# Altium project CanRotor_Mini(ver.8).PrjPcb
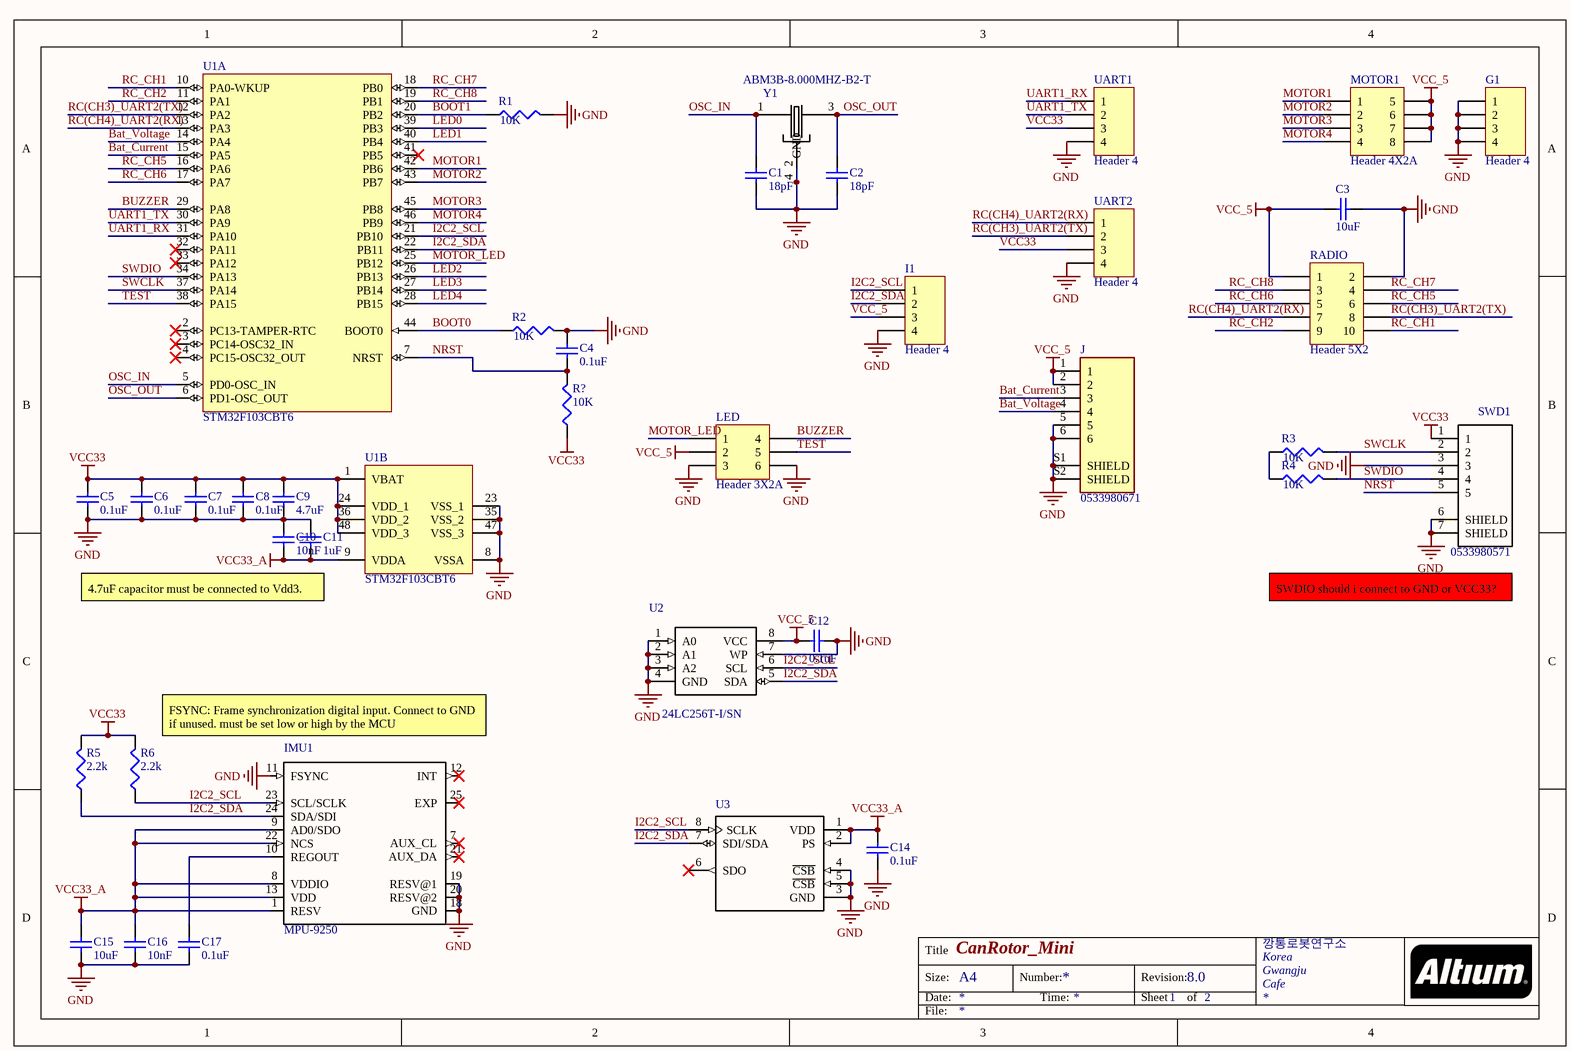
[diagram p0: CanRotor_Mini(1).SchDoc]
2 sheets, 58 parts. Net scope: global (net labels, ports and power ports of the same name join across sheets).
Board file: CanRotor_Mini(PCB).PcbDoc
Sheets:
  CanRotor_Mini(1).SchDoc
  CanRotor_Mini(2).SchDoc

## Sheet CanRotor_Mini(1).SchDoc: CanRotor_Mini
size A4; Author: WHS; Organization: 깡통로봇연구소; Address1: Korea; Address2: Gwangju; Address3: Cafe; Revision: 8.0; SheetNumber: 1; SheetTotal: 2; ProjectName: CanRotor_Mini

### Parts
C1  value 18pF  [1608[0603]]  (hidden comment: Cap Semi)
C2  value 18pF  [1608[0603]]  (hidden comment: Cap Semi)
C3  value 10uF  [6-0805_L]  (hidden comment: Cap Semi)
C4  value 0.1uF  [1608[0603]]  (hidden comment: Cap Semi)
C5  value 0.1uF  [1608[0603]]  (hidden comment: Cap Semi)
C6  value 0.1uF  [1608[0603]]  (hidden comment: Cap Semi)
C7  value 0.1uF  [1608[0603]]  (hidden comment: Cap Semi)
C8  value 0.1uF  [1608[0603]]  (hidden comment: Cap Semi)
C9  value 4.7uF  [6-0805_L]  (hidden comment: Cap Semi)
C10  value 10nF  [1608[0603]]  (hidden comment: Cap Semi)
C11  value 1uF  [1608[0603]]  (hidden comment: Cap Semi)
C12  value 0.1uF  [1608[0603]]  (hidden comment: Cap Semi)
C14  value 0.1uF  [1608[0603]]  (hidden comment: Cap Semi)
C15  value 10uF  [6-0805_L]  (hidden comment: Cap Semi)
C16  value 10nF  [1608[0603]]  (hidden comment: Cap Semi)
C17  value 0.1uF  [1608[0603]]  (hidden comment: Cap Semi)
G1  Header 4  [HDR1X4]
I1  Header 4  [HDR1X4]
IMU1  MPU-9250  [QFN40P300X300X105-25N]
J  0533980671  [MOLEX_0533980671]
LED  Header 3X2A  [HDR2X3_CEN]
MOTOR1  Header 4X2A  [HDR2X4_CEN]
R1  value 10K  [J1-0603]  (hidden comment: Res3)
R2  value 10K  [J1-0603]  (hidden comment: Res3)
R3  value 10K  [J1-0603]  (hidden comment: Res3)
R4  value 10K  [J1-0603]  (hidden comment: Res3)
R5  value 2.2k  [J1-0603]  (hidden comment: Res3)
R6  value 2.2k  [J1-0603]  (hidden comment: Res3)
R?  value 10K  [J1-0603]  (hidden comment: Res3)
RADIO  Header 5X2  [HDR2X5]
SWD1  0533980571  [MOLEX_0533980571_0533980571(Primary)]
U1  STM32F103CBT6  [STM-LQFP48_N]  (parts A,B of 2)
U2  24LC256T-I/SN  [SOIC127P600X175-8N]
U3  MS561101BA03-50  [SON125P500X300X100-8N]  (value not drawn)
UART1  Header 4  [HDR1X4]
UART2  Header 4  [HDR1X4]
Y1  ABM3B-8.000MHZ-B2-T  [OSCSC500X320X110-4N]

### Nets
GND: C1.1 C2.1 C3.2 C4.2 C5.1 C6.1 C7.1 C8.1 C9.2 C10.1 C11.1 C12.1 C14.1 C15.1 C16.1 C17.1 G1.1 G1.2 G1.3 G1.4 I1.4 IMU1.11(FSYNC) IMU1.18(GND) IMU1.19(RESV@1) IMU1.20(RESV@2) J.5 J.6 J.S1(SHIELD) J.S2(SHIELD) LED.3 LED.6 R1.2 R2.2 RADIO.2 SWD1.3 SWD1.6(SHIELD) SWD1.7(SHIELD) U1.8(VSSA) U1.23(VSS_1) U1.35(VSS_2) U1.47(VSS_3) U2.1(A0) U2.2(A1) U2.3(A2) U2.4(GND) U2.7(WP) U3.3(GND) U3.4(~{CSB}) U3.5(~{CSB}) UART1.4 UART2.4 Y1.2(GND) Y1.4(GND)
VCC33: C5.2 C6.2 C7.2 C8.2 C9.1 R5.2 R6.2 R?.1 SWD1.1 U1.1(VBAT) U1.24(VDD_1) U1.36(VDD_2) U1.48(VDD_3) UART1.3 UART2.3
VCC33_A: C10.2 C11.2 C14.2 C15.2 C16.2 IMU1.1(RESV) IMU1.8(VDDIO) IMU1.9(AD0/SDO) IMU1.13(VDD) IMU1.22(NCS) U1.9(VDDA) U3.1(VDD) U3.2(PS)
VCC_5: C3.1 C12.2 I1.3 J.1 J.2 LED.2 MOTOR1.5 MOTOR1.6 MOTOR1.7 MOTOR1.8 RADIO.1 U2.8(VCC)
Bat_Current: J.3 U1.15(PA5)
Bat_Voltage: J.4 U1.14(PA4)
BOOT0: R2.1 U1.44(BOOT0)
BOOT1: R1.1 U1.20(PB2)
BUZZER: LED.4 U1.29(PA8)
I2C2_SCL: I1.1 IMU1.23(SCL/SCLK) R6.1 U1.21(PB10) U2.6(SCL) U3.8(SCLK)
I2C2_SDA: I1.2 IMU1.24(SDA/SDI) R5.1 U1.22(PB11) U2.5(SDA) U3.7(SDI/SDA)
LED0: U1.39(PB3)
LED1: U1.40(PB4)
LED2: U1.26(PB13)
LED3: U1.27(PB14)
LED4: U1.28(PB15)
MOTOR1: MOTOR1.1 U1.42(PB6)
MOTOR2: MOTOR1.2 U1.43(PB7)
MOTOR3: MOTOR1.3 U1.45(PB8)
MOTOR4: MOTOR1.4 U1.46(PB9)
MOTOR_LED: LED.1 U1.25(PB12)
NRST: C4.1 R?.2 SWD1.5 U1.7(NRST)
OSC_IN: C1.2 U1.5(PD0-OSC_IN) Y1.1
OSC_OUT: C2.2 U1.6(PD1-OSC_OUT) Y1.3
RC(CH3)_UART2(TX): RADIO.8 U1.12(PA2) UART2.2
RC(CH4)_UART2(RX): RADIO.7 U1.13(PA3) UART2.1
RC_CH1: RADIO.10 U1.10(PA0-WKUP)
RC_CH2: RADIO.9 U1.11(PA1)
RC_CH5: RADIO.6 U1.16(PA6)
RC_CH6: RADIO.5 U1.17(PA7)
RC_CH7: RADIO.4 U1.18(PB0)
RC_CH8: RADIO.3 U1.19(PB1)
SWCLK: R3.2 SWD1.2 U1.37(PA14)
SWDIO: R4.2 SWD1.4 U1.34(PA13)
TEST: LED.5 U1.38(PA15)
UART1_RX: U1.31(PA10) UART1.1
UART1_TX: U1.30(PA9) UART1.2
NetC17_2: C17.2 IMU1.10(REGOUT)
NetR3_1: R3.1 R4.1

Not connected (* = marked no-connect by the designer): IMU1 7(AUX_CL)* 12(INT)* 21(AUX_DA)* 25(EXP)*; U1 2(PC13-TAMPER-RTC)* 3(PC14-OSC32_IN)* 4(PC15-OSC32_OUT)* 32(PA11)* 33(PA12)* 41(PB5)*; U3 6(SDO)*

### Notes on the sheet
- 4.7uF capacitor must be connected to Vdd3.
- (near SWD1) SWDIO should i connect to GND or VCC33?
- FSYNC: Frame synchronization digital input. Connect to GND if unused. must be set low or high by the MCU
- Title
- Size:
- Date:
- A4
- Number:
- Time:
- Revision:
- Sheet
- of
- File:

### Library data of the parts
C1-C12 C14-C17 = Cap Semi: Capacitor (Semiconductor SIM Model); Published: 8-Jun-2000; LatestRevisionDate: 29-May-2009; LatestRevisionNote: IPC-7351 Footprint Added.; PackageReference: C1206; Publisher: Altium Limited; PackageDescription: Chip Capacitor
G1 I1 UART1 UART2 = Header 4: Header, 4-Pin; LatestRevisionDate: 17-Jul-2002; LatestRevisionNote: Re-released for DXP Platform.; Publisher: Altium Limited
IMU1 = MPU-9250: SMD Gyroscope/Accelerometer/Magnetometer Sensor%3B 9-AXIS; MF: InvenSense; Package: QFN-24 InvenSense; Price: 6.07 USD; MP: MPU-9250; Availability: Warning; Value: *
J = 0533980671: Picoblade Connector, 6 Circuit Single Row, Right Angle Surface Mount SMT PCB; MF: Molex; SnapEDA_Link: https://www.snapeda.com/parts/0533980671/Molex/view-part/49734/?ref=snap; Availability: Unavailable; Value: *; Price: None; MP: 0533980671; Package: None
LED = Header 3X2A: Header, 3-Pin, Dual row; LatestRevisionDate: 17-Jul-2002; LatestRevisionNote: Re-released for DXP Platform.; Publisher: Altium Limited
MOTOR1 = Header 4X2A: Header, 4-Pin, Dual row; LatestRevisionDate: 17-Jul-2002; LatestRevisionNote: Re-released for DXP Platform.; Publisher: Altium Limited
R1-R6 R? = Res3: Resistor; Published: 8-Jun-2000; LatestRevisionDate: 29-May-2009; LatestRevisionNote: IPC-7351 Footprint Added.; PackageReference: J1-0603; Publisher: Altium Limited; PackageDescription: Chip Resistor
RADIO = Header 5X2: Header, 5-Pin, Dual row; LatestRevisionDate: 17-Jul-2002; LatestRevisionNote: Re-released for DXP Platform.; Publisher: Altium Limited
SWD1 = 0533980571: Conn Shrouded Header HDR 5 POS 1.25mm Solder ST SMD PicoBlade횄짖창?혷횂짖 Embossed T/R; MF: Molex, LLC; SnapEDA_Link: https://www.snapeda.com/parts/0533980571/Molex%2C%20LLC/view-part/?ref=snap; Package: None; MP: 0533980571; Availability: Unavailable; Price: None; Value: *
U1 = STM32F103CBT6: ARM Cortex-M3 32-bit MCU, 128 KB Flash, 20 KB Internal RAM, 37 I/Os, 48-pin LQFP, -40 to 85 degC, Tray; A/D Converter: 2x12-bit (10 Channel); FLASH Size (Prog) (kB): 128; I/Os (High Current): 37; Internal RAM Size (kB): 20; Operating Frequency(F) (Processor speed) (MHz): 72; Supply Voltage(Vcc) min (V): 2; DatasheetVersion: Rev. 16; PackageVersion: Rev. 6, 06/2013; PackageReference: LQFP48; PackageDescription: 48-Pin Low Profile Quad Flat Package, 7 x 7 mm Body, 0.5 mm Pitch; Supplier 1: Digi-Key; Supplier Part Number 1: 497-6288-ND; Supplier 2: Farnell; Supplier Part Number 2: 1606327; Supplier 3: Newark; Supplier Part Number 3: 11N8296; Supplier 4: Newark; Supplier Part Number 4: 57P1214; Supplier 5: Mouser; Supplier Part Number 5: 511-STM32F103CBT6; Core: ARM Cortex-M3; Packing: Tray; Mounting Technology: Surface Mount; PartNumber: STM32F103CBT6; ComponentLink1Description: Manufacturer URL; ComponentLink1URL: http://www.st.com/web/en/home.html; ComponentLink2Description: Datasheet; ComponentLink2URL: http://www.st.com/st-web-ui/static/active/en/resource/technical/document/datasheet/CD00161566.pdf; ComponentLink3Description: Package Specification; ComponentLink3URL: http://www.st.com/st-web-ui/static/active/en/resource/technical/document/datasheet/DM00058181.pdf
U2 = 24LC256T-I/SN: EEPROM Serial-I2C 256K-bit 32K x 8 3.3V/5V 8-Pin SOIC N T/R; MF: Microchip; SnapEDA_Link: https://www.snapeda.com/parts/24LC256T-I/SN/Microchip/view-part/?ref=snap; Package: SOIC-8 Microchip; MP: 24LC256T-I/SN; Availability: Unavailable; Price: None; Value: *
U3 = MS561101BA03-50: Pressure Sensor 1.44V to 3.6V 0.01bar to 1.2bar Absolute 8-Pin QFN T/R; MF: TE Connectivity; Availability: Unavailable; MP: MS561101BA03-50; Package: SMD-8 Measurement Specialties; SnapEDA_Link: https://www.snapeda.com/parts/MS561101BA03-50/TE%20Connectivity%20ALCOSWITCH%20Switches/view-part/?ref=snap; TE_purchase_URL: https://www.te.com/usa-en/product-MS561101BA03-50.html?te_bu=Cor&te_type=disp&te_campaign=seda_glo_cor-seda-global-disp-prtnr-fy19-seda-model-bom-cta_sma-317_1&elqCampaignId=32493; Price: None; Value: *
Y1 = ABM3B-8.000MHZ-B2-T: Crystal 8MHz %C2%B120ppm %28Tol%29 %C2%B150ppm %28Stability%29 18pF FUND 200Ohm 4-Pin CSMD T/R; MF: Abracon; MP: ABM3B-8.000MHZ-B2-T; Package: 5.0 x 3.2mm Abracon; Price: 0.47 USD; Availability: Good; Value: *

## Sheet CanRotor_Mini(2).SchDoc: Canrotor_Mini
size A4; Author: WHS; Organization: 깡통로봇연구소; Address1: Korea; Address2: Gwangju; Address3: Cafe; Revision: 8.0; SheetNumber: 2; SheetTotal: 2; ProjectName: CanRotor_Mini
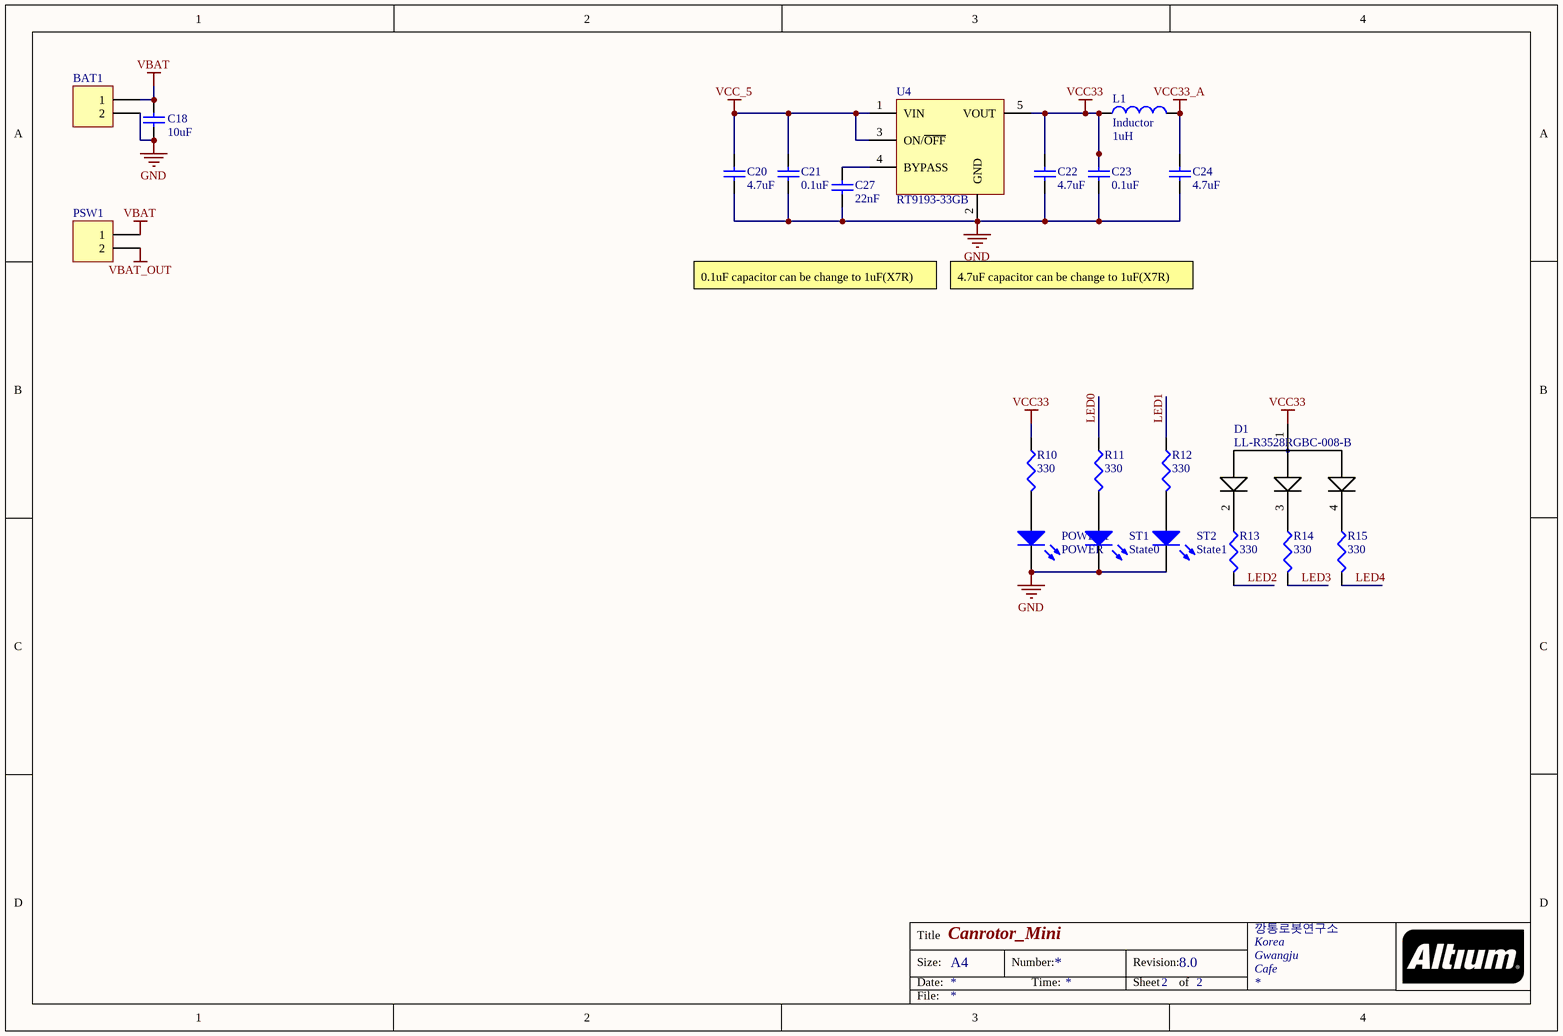
[diagram p1: CanRotor_Mini(2).SchDoc]

### Parts
BAT1  Header 2  [HDR1X2]  (value not drawn)
C18  value 10uF  [C1206]  (hidden comment: Cap Semi)
C20  value 4.7uF  [C1206]  (hidden comment: Cap Semi)
C21  value 0.1uF  [1608[0603]]  (hidden comment: Cap Semi)
C22  value 4.7uF  [6-0805_L]  (hidden comment: Cap Semi)
C23  value 0.1uF  [1608[0603]]  (hidden comment: Cap Semi)
C24  value 4.7uF  [6-0805_L]  (hidden comment: Cap Semi)
C27  value 22nF  [1608[0603]]  (hidden comment: Cap Semi)
D1  LL-R3528RGBC-008-B  [LED_LL-R3528RGBC-008-B]
L1  Inductor  value 1uH  [1608[0603]]
POWER1  POWER  [LED0603]
PSW1  Header 2  [HDR1X2]  (value not drawn)
R10  value 330  [J1-0603]  (hidden comment: Res3)
R11  value 330  [J1-0603]  (hidden comment: Res3)
R12  value 330  [J1-0603]  (hidden comment: Res3)
R13  value 330  [J1-0603]  (hidden comment: Res3)
R14  value 330  [J1-0603]  (hidden comment: Res3)
R15  value 330  [J1-0603]  (hidden comment: Res3)
ST1  State0  [LED0603]
ST2  State1  [LED0603]
U4  RT9193-33GB  [SOT-23-5]

### Nets
GND: BAT1.2 C18.2 C20.2 C21.2 C22.2 C23.2 C24.2 C27.2 POWER1.2(K) ST1.2(K) ST2.2(K) U4.2(GND)
VBAT: BAT1.1 C18.1 PSW1.1
VBAT_OUT: PSW1.2
VCC33: C22.1 C23.1 D1.1(COMM_ANODE) L1.1 R10.1 U4.5(VOUT)
VCC33_A: C24.1 L1.2
VCC_5: C20.1 C21.1 U4.1(VIN) U4.3(ON/~{OFF})
LED0: R11.1
LED1: R12.1
LED2: R13.2
LED3: R14.2
LED4: R15.2
NetC27_1: C27.1 U4.4(BYPASS)
NetD1_2: D1.2(CATHODE_RED) R13.1
NetD1_3: D1.3(CATHODE_GREEN) R14.1
NetD1_4: D1.4(CATHODE_BLUE) R15.1
NetPOWER1_1: POWER1.1(A) R10.2
NetR11_2: R11.2 ST1.1(A)
NetR12_2: R12.2 ST2.1(A)

### Notes on the sheet
- 0.1uF capacitor can be change to 1uF(X7R)
- 4.7uF capacitor can be change to 1uF(X7R)
- Title
- Size:
- Date:
- A4
- Number:
- Time:
- Revision:
- Sheet
- of
- File:

### Library data of the parts
BAT1 PSW1 = Header 2: Header, 2-Pin; LatestRevisionDate: 17-Jul-2002; LatestRevisionNote: Re-released for DXP Platform.; Publisher: Altium Limited
C18 C20-C24 C27 = Cap Semi: Capacitor (Semiconductor SIM Model); Published: 8-Jun-2000; LatestRevisionDate: 29-May-2009; LatestRevisionNote: IPC-7351 Footprint Added.; PackageReference: C1206; Publisher: Altium Limited; PackageDescription: Chip Capacitor
D1 = LL-R3528RGBC-008-B: LED; SMD; 3528, PLCC2; RGB; 3.5x2.8mm; 120째; Red lumin: 1; MF: Lucky Light; SnapEDA_Link: https://www.snapeda.com/parts/LL-R3528RGBC-008-B/Lucky%20Light/view-part/?ref=snap; Package: PLCC-2 Lucky Light; MP: LL-R3528RGBC-008-B; Availability: Unavailable; Price: None; Value: *
L1 = Inductor: Code_IEC: 1005; Published: 8-Jun-2000; LatestRevisionDate: 29-May-2009; LatestRevisionNote: IPC-7351 Footprint Added.; PackageReference: 0402-A; Publisher: Altium Limited; PackageDescription: Chip Inductor; Code_JEITA: 0402
POWER1 ST1 ST2 = LED2: Typical RED, GREEN, YELLOW, AMBER GaAs LED; Published: 8-Jun-2000; LatestRevisionDate: 17-Jul-2002; LatestRevisionNote: Re-released for DXP Platform.; PackageVersion: Feb-2002; PackageReference: 3.2X1.6X1.1; Publisher: Altium Limited; PackageDescription: SM LED; 2 Flat Leads
R10-R15 = Res3: Resistor; Published: 8-Jun-2000; LatestRevisionDate: 29-May-2009; LatestRevisionNote: IPC-7351 Footprint Added.; PackageReference: J1-0603; Publisher: Altium Limited; PackageDescription: Chip Resistor

## Nets that join several sheets
GND: CanRotor_Mini(1) (53 pins), CanRotor_Mini(2) (12 pins)
VCC33: CanRotor_Mini(1) (15 pins), CanRotor_Mini(2) (6 pins)
VCC33_A: CanRotor_Mini(1) (13 pins), CanRotor_Mini(2) (C24.1 L1.2)
VCC_5: CanRotor_Mini(1) (12 pins), CanRotor_Mini(2) (C20.1 C21.1 U4.1 U4.3)
LED0: CanRotor_Mini(1) (U1.39), CanRotor_Mini(2) (R11.1)
LED1: CanRotor_Mini(1) (U1.40), CanRotor_Mini(2) (R12.1)
LED2: CanRotor_Mini(1) (U1.26), CanRotor_Mini(2) (R13.2)
LED3: CanRotor_Mini(1) (U1.27), CanRotor_Mini(2) (R14.2)
LED4: CanRotor_Mini(1) (U1.28), CanRotor_Mini(2) (R15.2)